# Altium schematic sheet LoRa_Com.SchDoc
size A4; Author: İlker KESER; Revision: V1.0; SheetNumber: 7; SheetTotal: 9; Page: 7; Project Code: 02050838; Template: A4; Page Total: 9
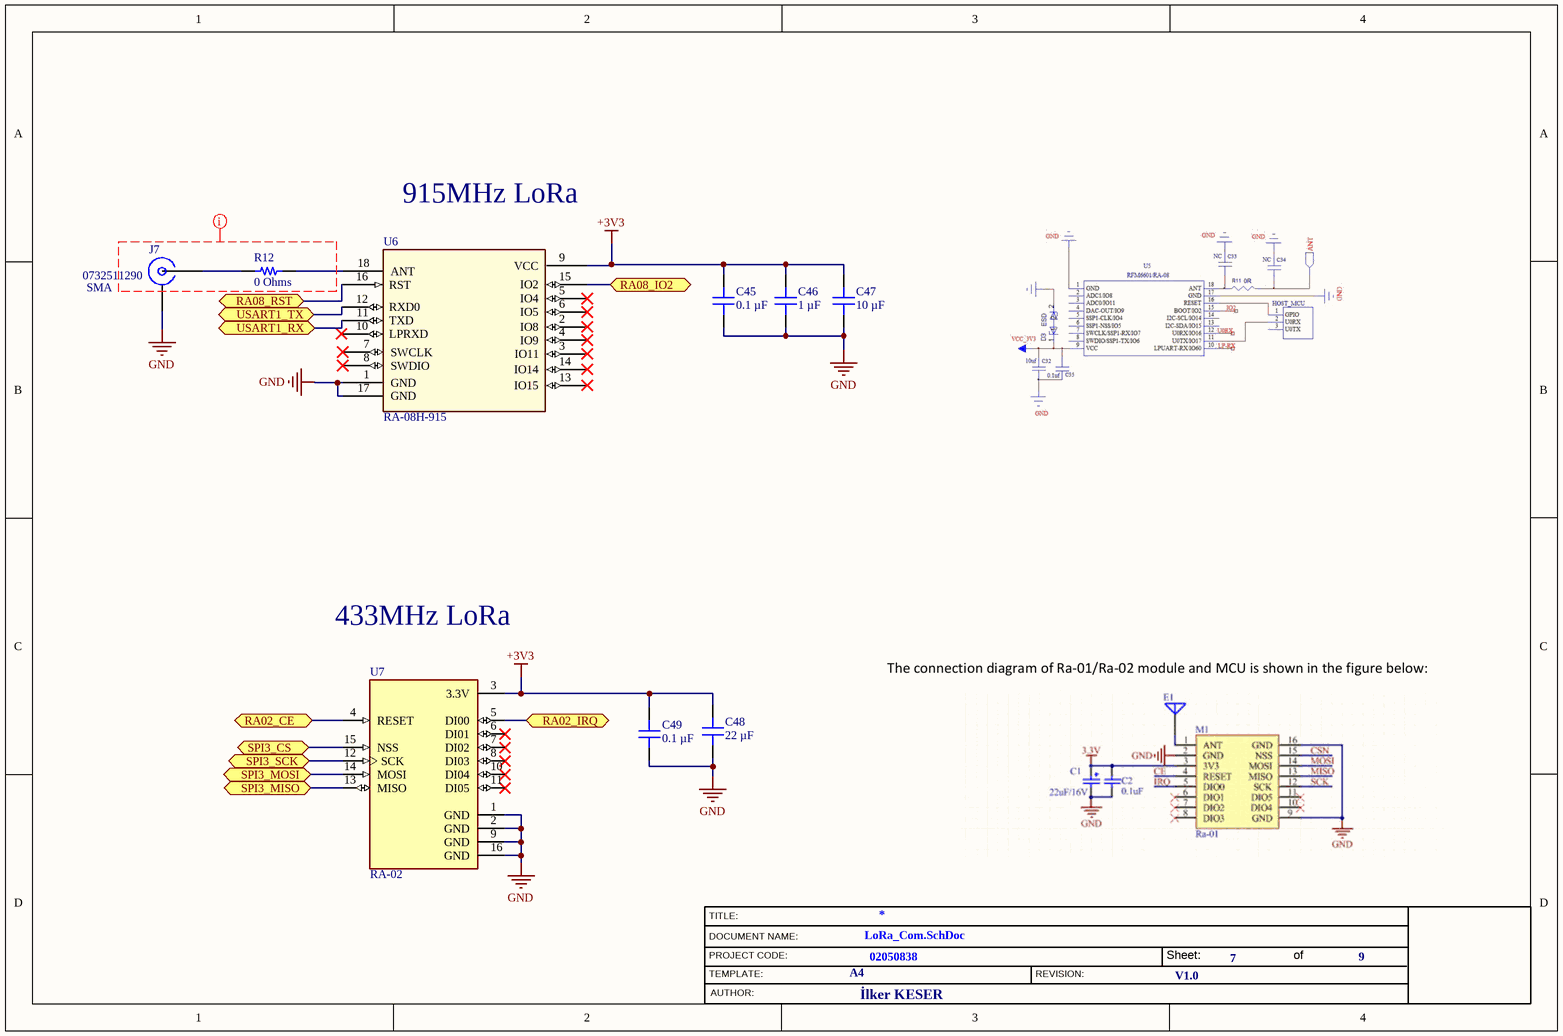
[diagram p0: LoRa_Com.SchDoc]

## Parts
C45  0.1 µF  [CAP 0402_1005]
C46  1 µF  [CAP 0402_1005]
C47  10 µF  [MURATA GRM188 0603_1608]
C48  22 µF  [MURATA GRM188 0603_1608]
C49  0.1 µF  [CAP 0603_1608]
J7  0732511290  Connector Style: SMA  [MOLEX SD-73251-129]
R12  0 Ohms  [RES 1206_3216]
U6  RA-08H-915  [RA-08H-915]
U7  RA-02  [RA-02]

## Ports
RA02_CE (bidir, see Microcontroller[2B]), RA02_IRQ (bidir, see Microcontroller[2B]), RA08_IO2 (bidir, see Microcontroller[1B]), RA08_RST (bidir, see Microcontroller[1A]), SPI3_CS (bidir, see Microcontroller[2B]), SPI3_MISO (bidir, see Microcontroller[1C]), SPI3_MOSI (bidir, see Microcontroller[1C]), SPI3_SCK (bidir, see Microcontroller[1C]), USART1_RX (bidir, see Microcontroller[1B]), USART1_TX (bidir, see Microcontroller[1B])

## Nets
+3V3: C45.2 C46.2 C47.2 C48.2 C49.2 U6.9(VCC) U7.3(3.3V)
GND: C45.1 C46.1 C47.1 C48.1 C49.1 J7.G(GND) U6.1(GND) U6.17(GND) U7.1(GND) U7.2(GND) U7.9(GND) U7.16(GND)
RA02_CE: U7.4(RESET) ; port RA02_CE
RA02_IRQ: U7.5(DI00) ; port RA02_IRQ
RA08_IO2: U6.15(IO2) ; port RA08_IO2
RA08_RST: U6.16(RST) ; port RA08_RST
SPI3_CS: U7.15(NSS) ; port SPI3_CS
SPI3_MISO: U7.13(MISO) ; port SPI3_MISO
SPI3_MOSI: U7.14(MOSI) ; port SPI3_MOSI
SPI3_SCK: U7.12(SCK) ; port SPI3_SCK
USART1_RX: U6.11(TXD) ; port USART1_RX
USART1_TX: U6.12(RXD0) ; port USART1_TX
NetJ7_S: J7.S(SIGNAL) R12.1
NetR12_2: R12.2 U6.18(ANT)

Not connected (* = marked no-connect by the designer): U6 2(IO8)* 3(IO11)* 4(IO9)* 5(IO4)* 6(IO5)* 7(SWCLK)* 8(SWDIO)* 10(LPRXD)* 13(IO15)* 14(IO14)*; U7 6(DI01)* 7(DI02)* 8(DI03)* 10(DI04)* 11(DI05)*

## Layout directives
net class 50OHM: (no net found under the mark)

## Notes on the sheet
- 915MHz LoRa
- 433MHz LoRa
- TITLE:
- DOCUMENT NAME:
- PROJECT CODE:
- TEMPLATE:
- REVISION:
- Sheet:
- of
- AUTHOR:

## Library data of the parts
C45 = C0402C104M9PAC7867: CAP CER 0.1UF 6.3V X5R 0402; manufacturer: KEMET; Tolerance: ±20%; Part Number: C0402C104M9PAC7867; Capacitance: 0.1 µF; Applications: Bypass, Decoupling; componentlink1description: Datasheet; componentlink1url: https://api.kemet.com/component-edge/download/datasheet/C0402C104M9PACTU.pdf; componentlink2description: DigiKey Link; componentlink2url: https://www.digikey.com/en/products/detail/kemet/C0402C104M9PAC7867/2196244; Device Package: 0402 (1005 Metric); lastupdated: 9.02.2024 20:04:15; Lifecycle Status: Active; Minimum Order: 1; Mounting Type: Surface Mount, MLCC; Operating Temperature: -55°C ~ 85°C; Package / Case: 0402 (1005 Metric); packaging: CutTape; partid: 33676; Part Status: Active; price: 0.01; series: SMD Comm X5R; Size / Dimension: 0.039" L x 0.020" W (1.00mm x 0.50mm); Supplier 1: DigiKey; Supplier Part Number 1: 399-C0402C104M9PAC7867CT-ND; Temperature Coefficient: X5R; Thickness (Max): 0.022" (0.55mm); value: 0.1 µF; Voltage - Rated: 6.3V
C46 = GRM152R60J105ME15D: CAP CER 1UF 6.3V X5R 0402; manufacturer: Murata Electronics; Tolerance: ±20%; Part Number: GRM152R60J105ME15D; Capacitance: 1 µF; Applications: General Purpose; componentlink1description: Datasheet; componentlink1url: https://search.murata.co.jp/Ceramy/image/img/A01X/G101/ENG/GRM152R60J105ME15-01.pdf; componentlink2description: DigiKey Link; componentlink2url: https://www.digikey.com/en/products/detail/murata-electronics/GRM152R60J105ME15D/4904809; Device Package: 0402 (1005 Metric); lastupdated: 9.02.2024 20:04:33; Lifecycle Status: Active; Minimum Order: 1; Mounting Type: Surface Mount, MLCC; Operating Temperature: -55°C ~ 85°C; Package / Case: 0402 (1005 Metric); packaging: TapeAndReel; partid: 4147; Part Status: Active; price: 0.03; series: GRM; Size / Dimension: 0.039" L x 0.020" W (1.00mm x 0.50mm); Supplier 1: DigiKey; Supplier Part Number 1: 490-10006-1-ND; Temperature Coefficient: X5R; Thickness (Max): 0.009" (0.22mm); value: 1 µF; Voltage - Rated: 6.3V
C47 = GRM188R61A106MAALD: CAP CER 10UF 10V X5R 0603; manufacturer: Murata Electronics; Tolerance: ±20%; Part Number: GRM188R61A106MAALD; Capacitance: 10 µF; Applications: General Purpose; componentlink1description: Datasheet; componentlink1url: https://search.murata.co.jp/Ceramy/image/img/A01X/G101/ENG/GRM188R61A106MAAL-01.pdf; componentlink2description: DigiKey Link; componentlink2url: https://www.digikey.com/en/products/detail/murata-electronics/GRM188R61A106MAALD/4905335; Device Package: 0603 (1608 Metric); lastupdated: 20.07.2024 00:23:22; Lifecycle Status: Active; Minimum Order: 1; Mounting Type: Surface Mount, MLCC; Operating Temperature: -55°C ~ 85°C; Package / Case: 0603 (1608 Metric); packaging: TapeAndReel; partid: 40505; Part Status: Active; price: 0.03; series: GRM; Size / Dimension: 0.063" L x 0.031" W (1.60mm x 0.80mm); Supplier 1: DigiKey; Supplier Part Number 1: 490-12734-1-ND; Temperature Coefficient: X5R; Thickness (Max): 0.037" (0.95mm); value: 10 µF; Voltage - Rated: 10V
C48 = GRM188C61C226ME01W: CAP CER 22UF 16V X5S 0603; manufacturer: Murata Electronics; Tolerance: ±20%; Part Number: GRM188C61C226ME01W; Capacitance: 22 µF; Applications: General Purpose; componentlink1description: Datasheet; componentlink1url: https://search.murata.co.jp/Ceramy/image/img/A01X/G101/ENG/GRM188C61C226ME01-01A.pdf; componentlink2description: DigiKey Link; componentlink2url: https://www.digikey.com/en/products/detail/murata-electronics/GRM188C61C226ME01W/22528390; Device Package: 0603 (1608 Metric); lastupdated: 20.07.2024 00:23:18; Lifecycle Status: Active; Minimum Order: 1; Mounting Type: Surface Mount, MLCC; Operating Temperature: -55°C ~ 85°C; Package / Case: 0603 (1608 Metric); packaging: TapeAndReel; partid: 60288; price: 0.09; series: GRM; Size / Dimension: 0.063" L x 0.031" W (1.60mm x 0.80mm); Supplier 1: DigiKey; Supplier Part Number 1: 490-GRM188C61C226ME01WCT-ND; Temperature Coefficient: X5S; Thickness (Max): 0.039" (1.00mm); value: 22 µF; Voltage - Rated: 16V
C49 = 885012206046: CAP CER 0.1UF 16V X7R 0603; manufacturer: Würth Elektronik; Tolerance: ±10%; Part Number: 885012206046; Capacitance: 0.1 µF; Applications: General Purpose; componentlink1description: Datasheet; componentlink1url: https://katalog.we-online.de/pbs/datasheet/885012206046.pdf; componentlink2description: DigiKey Link; componentlink2url: https://www.digikey.com/en/products/detail/würth-elektronik/885012206046/5453820; Device Package: 0603 (1608 Metric); lastupdated: 9.02.2024 20:10:12; Lifecycle Status: Active; Minimum Order: 1; Mounting Type: Surface Mount, MLCC; Operating Temperature: -55°C ~ 125°C; Package / Case: 0603 (1608 Metric); packaging: TapeAndReel; partid: 15291; Part Status: Active; price: 0.03; series: WCAP-CSGP; Size / Dimension: 0.063" L x 0.031" W (1.60mm x 0.80mm); Supplier 1: DigiKey; Supplier Part Number 1: 732-7965-1-ND; Temperature Coefficient: X7R; Thickness (Max): 0.034" (0.87mm); value: 0.1 µF; Voltage - Rated: 16V
J7 = 0732511290: CONN SMA JACK STR 50OHM EDGE MNT; Manufacturer: Molex; Connector Type: Jack, Female Socket; Contact Termination: Solder; Frequency - Max: 18 GHz; Number of Ports: 1; Part Number: 0732511290; ComponentLink1Description: Datasheet; ComponentLink1URL: https://www.molex.com/pdm_docs/ps/PS-89675-346.pdf; ComponentLink2Description: DigiKey Link; ComponentLink2URL: https://www.digikey.com/en/products/detail/molex/0732511290/3878247; Fastening Type: Threaded; Housing Color: Gold; Impedance: 50Ohm; LastUpdated: 29.06.2022 18:07:55; Lifecycle Status: Active; Minimum Order: 1; Mounting Feature: Bulkhead - Front Side Nut; Mounting Type: Board Edge, End Launch; Panel Mount; Packaging: Tray; Part Status: Active; Price: 4.46; Series: 73251; Shield Termination: Solder; Supplier 1: DigiKey; Supplier Part Number 1: WM9461-ND
R12 = CRCW12060000Z0EB: RES SMD 0 OHM JUMPER 1/4W 1206; Manufacturer: Vishay Dale; Power (Watts): 0.25W, 1/4W; Part Number: CRCW12060000Z0EB; ComponentLink1Description: Datasheet; ComponentLink1URL: http://www.vishay.com/docs/20035/dcrcwe3.pdf; ComponentLink2Description: DigiKey Link; ComponentLink2URL: https://www.digikey.com/en/products/detail/vishay-dale/CRCW12060000Z0EB/5076259; Composition: Thick Film; Device Package: 1206 (3216 Metric); Features: Automotive AEC-Q200; Height - Seated (Max): 0.024" (0.60mm); LastUpdated: 9.02.2024 20:54:45; Lifecycle Status: Active; Minimum Order: 1; Number of Terminations: 2; Operating Temperature: -55°C ~ 155°C; Package / Case: 1206 (3216 Metric); Packaging: TapeAndReel; PartId: 26977; Part Status: Active; Price: 0.01; Ratings: AEC-Q200; Resistance: 0 Ohms; Series: CRCW; Size / Dimension: 0.126" L x 0.063" W (3.20mm x 1.60mm); Supplier 1: DigiKey; Supplier Part Number 1: 541-3032-1-ND; Supplier Device Package: 1206; Tolerance: Jumper; Value: 0 Ohms
U6 = RA-08H-915: RF TXRX MODULE 915MHZ LORAWAN; Manufacturer: Ai-Thinker; ComponentLink1Description: Datasheet; ComponentLink1URL: https://docs.ai-thinker.com/_media/lora/docs/ra-08h_v1.1.0_specification.pdf; ComponentLink2Description: Digikey Link; ComponentLink2URL: https://www.digikey.com/en/products/detail/ai-thinker/RA-08H-915/16707689
U7 = RA-02: General ISM < 1GHz LoRa™ Transceiver Module 410MHz ~ 525MHz Antenna Not Included, I-PEX Surface Mount; Manufacturer: Ai-Thinker; Current - Transmitting: 93mA ~ 97mA; Current - Receiving: 12.15mA; Voltage - Supply: 2.5V ~ 3.7V; Serial Interfaces: SPI; Protocol: LoRa; Modulation: FSK, GFSK, GMSK, MSK, OOK; Data Rate: 300kbps; Power - Output: 18dBm; Sensitivity: -141dBm; ComponentLink1Description: Product Specification; ComponentLink1URL: https://docs.ai-thinker.com/_media/lora/docs/c048ps01a1_ra-02_product_specification_v1.1.pdf; ComponentLink2Description: Digikey Link; ComponentLink2URL: https://www.digikey.com/en/products/detail/ai-thinker/RA-02/16688840; Package / Case: 16-SMD Module; Operating Temperature: -30°C ~ 85°C; Mounting Type: Surface Mount; Antenna Type: Antenna Not Included, I-PEX; RF Family/Standard: General ISM < 1GHz; Frequency: 410MHz ~ 525MHz